# Altium schematic sheet Encoder_BR.SchDoc
size A4; Date: 09 July 2012; Author: Simon Markham; DrawnBy: Simon Markham; Engineer: Simon Markham; Organization: Markham Designs
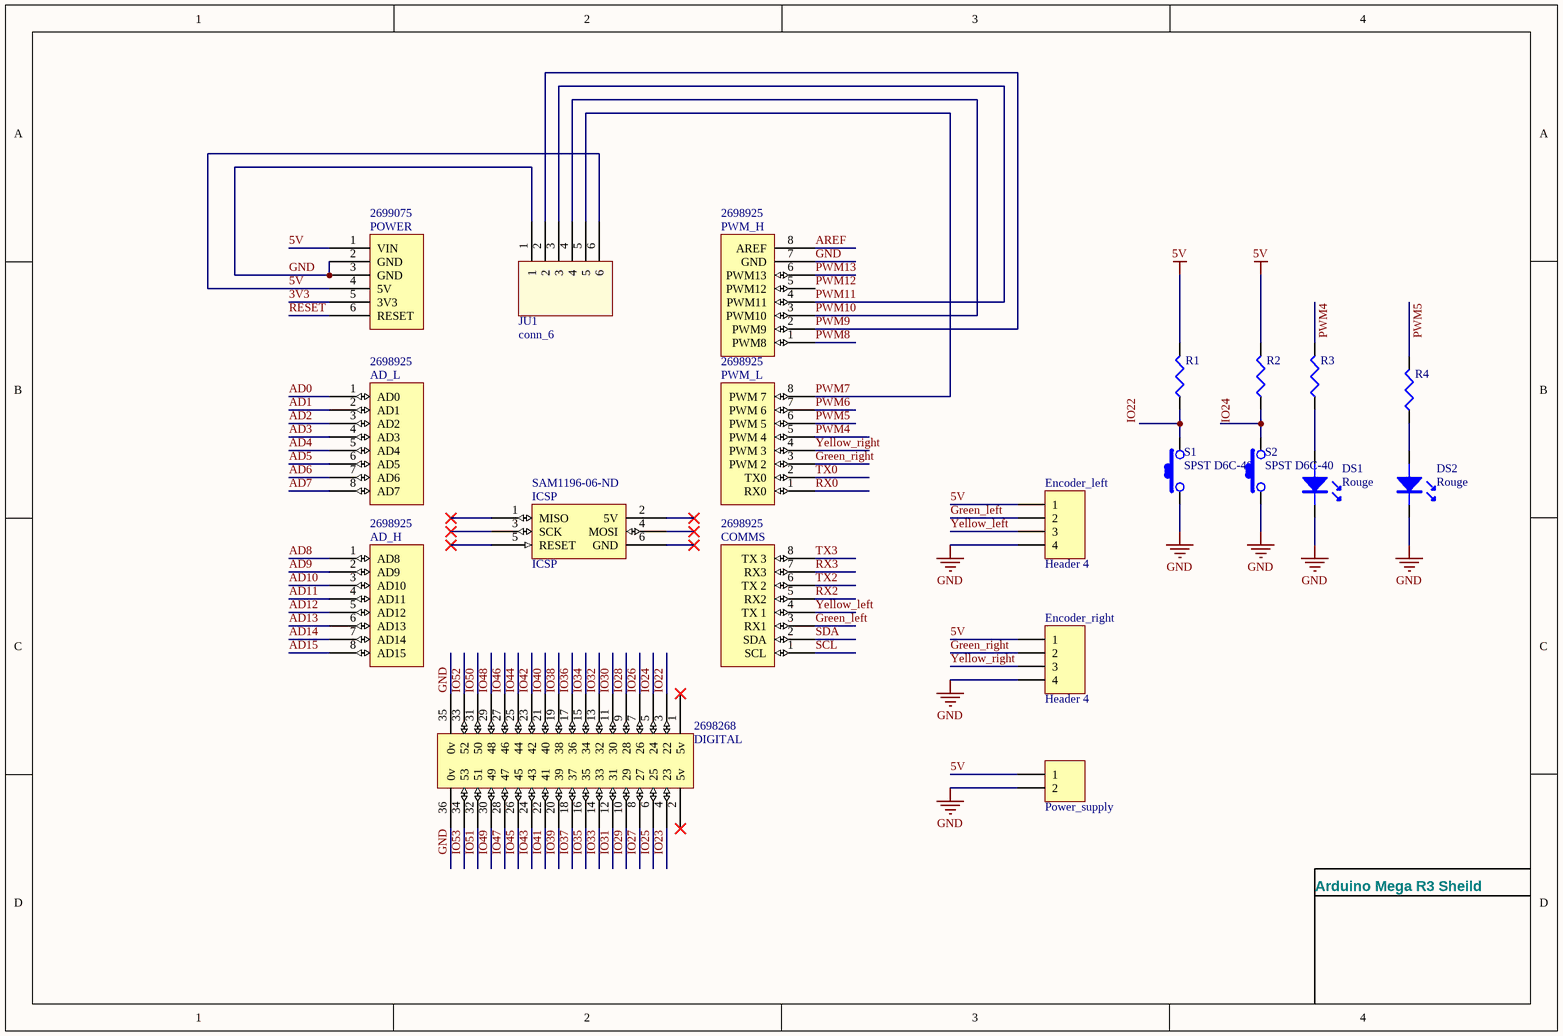
[diagram p0: Encoder_BR.SchDoc]

## Parts
AD_H  Supplier Part Number 4: 2698925  [Header 8x1 8.5mm]  (hidden comment: AD_H)
AD_L  Supplier Part Number 5: 2698925  [Header 8x1 8.5mm]  (hidden comment: AD_L)
COMMS  Supplier Part Number 4: 2698925  [Header 8x1 8.5mm]  (hidden comment: Communication)
DIGITAL  Supplier Part Number 5: 2698268  [HEADER 36X 8MM]  (hidden comment: IO_36)
DS1  Color: Rouge  [LED 0.1]  (hidden comment: LED)
DS2  Color: Rouge  [LED 0.1]  (hidden comment: LED)
Encoder_left  Header 4  [Header_4]
Encoder_right  Header 4  [Header_4]
ICSP  ICSP  Supplier Part Number 5: SAM1196-06-ND  [ICSP]
JU1  conn_6  [conn_6]
POWER  Supplier Part Number 2: 2699075  [Header 6x1 8.5mm]  (hidden comment: POWER)
Power_supply  Connecteur 2  [Header_2]  (value not drawn)
PWM_H  Supplier Part Number 4: 2698925  [Header 8x1 8.5mm]  (hidden comment: PWM_H)
PWM_L  Supplier Part Number 4: 2698925  [Header 8x1 8.5mm]  (hidden comment: PWM_L)
R1  Résistance  [AXIAL-0.3]  (value not drawn)
R2  Résistance  [AXIAL-0.3]  (value not drawn)
R3  Résistance  [AXIAL-0.3]  (value not drawn)
R4  Résistance  [AXIAL-0.3]  (value not drawn)
S1  Type: SPST D6C-40  [BP-D6 SPST]  (hidden comment: Bouton Poussoir D6)
S2  Type: SPST D6C-40  [BP-D6 SPST]  (hidden comment: Bouton Poussoir D6)

## Nets
5V: Encoder_left.1 Encoder_right.1 JU1.6 POWER.1(VIN) POWER.4(5V) Power_supply.1 R1.2 R2.2
GND: DIGITAL.35(0v) DIGITAL.36(0v) DS1.2(K) DS2.2(K) Encoder_left.4 Encoder_right.4 JU1.1 POWER.2(GND) POWER.3(GND) Power_supply.2 PWM_H.7(GND) S1.1 S2.1
3V3: POWER.5(3V3)
AD0: AD_L.1(AD0)
AD1: AD_L.2(AD1)
AD2: AD_L.3(AD2)
AD3: AD_L.4(AD3)
AD4: AD_L.5(AD4)
AD5: AD_L.6(AD5)
AD6: AD_L.7(AD6)
AD7: AD_L.8(AD7)
AD8: AD_H.1(AD8)
AD9: AD_H.2(AD9)
AD10: AD_H.3(AD10)
AD11: AD_H.4(AD11)
AD12: AD_H.5(AD12)
AD13: AD_H.6(AD13)
AD14: AD_H.7(AD14)
AD15: AD_H.8(AD15)
AREF: PWM_H.8(AREF)
Green_left: COMMS.3(RX1) Encoder_left.2
Green_right: Encoder_right.2 PWM_L.3(PWM_2)
IO22: DIGITAL.3(22) R1.1 S1.2
IO23: DIGITAL.4(23)
IO24: DIGITAL.5(24) R2.1 S2.2
IO25: DIGITAL.6(25)
IO26: DIGITAL.7(26)
IO27: DIGITAL.8(27)
IO28: DIGITAL.9(28)
IO29: DIGITAL.10(29)
IO30: DIGITAL.11(30)
IO31: DIGITAL.12(31)
IO32: DIGITAL.13(32)
IO33: DIGITAL.14(33)
IO34: DIGITAL.15(34)
IO35: DIGITAL.16(35)
IO36: DIGITAL.17(36)
IO37: DIGITAL.18(37)
IO38: DIGITAL.19(38)
IO39: DIGITAL.20(39)
IO40: DIGITAL.21(40)
IO41: DIGITAL.22(41)
IO42: DIGITAL.23(42)
IO43: DIGITAL.24(43)
IO44: DIGITAL.25(44)
IO45: DIGITAL.26(45)
IO46: DIGITAL.27(46)
IO47: DIGITAL.28(47)
IO48: DIGITAL.29(48)
IO49: DIGITAL.30(49)
IO50: DIGITAL.31(50)
IO51: DIGITAL.32(51)
IO52: DIGITAL.33(52)
IO53: DIGITAL.34(53)
PWM4: PWM_L.5(PWM_4) R3.2
PWM5: PWM_L.6(PWM_5) R4.2
PWM6: PWM_L.7(PWM_6)
PWM7: JU1.5 PWM_L.8(PWM_7)
PWM8: PWM_H.1(PWM8)
PWM9: JU1.2 PWM_H.2(PWM9)
PWM10: JU1.4 PWM_H.3(PWM10)
PWM11: JU1.3 PWM_H.4(PWM11)
PWM12: PWM_H.5(PWM12)
PWM13: PWM_H.6(PWM13)
RESET: POWER.6(RESET)
RX0: PWM_L.1(RX0)
RX2: COMMS.5(RX2)
RX3: COMMS.7(RX3)
SCL: COMMS.1(SCL)
SDA: COMMS.2(SDA)
TX0: PWM_L.2(TX0)
TX2: COMMS.6(TX_2)
TX3: COMMS.8(TX_3)
Yellow_left: COMMS.4(TX_1) Encoder_left.3
Yellow_right: Encoder_right.3 PWM_L.4(PWM_3)
NetDS1_1: DS1.1(A) R3.1
NetDS2_1: DS2.1(A) R4.1

Not connected (* = marked no-connect by the designer): DIGITAL 1(5v)* 2(5v)*; ICSP 1(MISO)* 2(5V)* 3(SCK)* 4(MOSI)* 5(RESET)* 6(GND)*

## Notes on the sheet
- Arduino Mega R3 Sheild

## Library data of the parts
Encoder_left Encoder_right = Header 4: Header, 4-Pin; LatestRevisionDate: 17-Jul-2002; LatestRevisionNote: Re-released for DXP Platform.; Publisher: Altium Limited; Supplier: Farnell 9731164
JU1 = conn_6: pin to pad: 1>2 2>3 3>4 4>5 5>6 6>1
Power_supply = Connecteur 2: Header 2; Designer: ECAM 2005; Supplier: ECAM; Type: Connecteur à vis
R1-R4 = Résistance: Résistance standard; Designer: ECAM 2005; Type: Résistance standard
S1 S2 = Bouton Poussoir D6: Bouton poussoir; Manufacturer: ITT CANON; Supplier: Farnell 151-141; Designer: ECAM 2004; Color: Rouge
AD_H = AD_H: Supplier 1: Arrow; Supplier Part Number 1: 2698940; Supplier 2: Arrow; Supplier Part Number 2: 2698939; Supplier 3: Digi-Key; Supplier Part Number 3: SAM1198-08-ND; Supplier 4: Arrow
AD_L = AD_L: Supplier 1: Digi-Key; Supplier Part Number 1: SAM1198-08-ND; Supplier 2: Arrow; Supplier Part Number 2: 2698939; Supplier 3: Arrow; Supplier Part Number 3: 2698940; Supplier 4: Arrow; Supplier Part Number 4: 43085273; Supplier 5: Arrow
COMMS = Communication: Supplier 1: Digi-Key; Supplier Part Number 1: SAM1198-08-ND; Supplier 2: Arrow; Supplier Part Number 2: 2698940; Supplier 3: Arrow; Supplier Part Number 3: 2698939; Supplier 4: Arrow
DIGITAL = IO_36: Supplier 1: Digi-Key; Supplier Part Number 1: SAM1196-18-ND; Supplier 2: Arrow; Supplier Part Number 2: 48117090; Supplier 3: Arrow; Supplier Part Number 3: 46093326; Supplier 4: Arrow; Supplier Part Number 4: 2698278; Supplier 5: Arrow
DS1 DS2 = LED: Designer: ECAM 2004; Type: LED
ICSP = ICSP: Supplier 1: Digi-Key; Supplier Part Number 1: SAM1185-06-ND; Supplier 2: Arrow; Supplier Part Number 2: 2699117; Supplier 3: Arrow; Supplier Part Number 3: 43862781; Supplier 4: Arrow; Supplier Part Number 4: 2699091; Supplier 5: Digi-Key
POWER = POWER: Supplier 1: Arrow; Supplier Part Number 1: 52553843; Supplier 2: Arrow; Supplier 3: Digi-Key; Supplier Part Number 3: SAM1198-06-ND; Supplier 4: Arrow; Supplier Part Number 4: 2699089; Supplier 5: Arrow; Supplier Part Number 5: 2699088
PWM_H = PWM_H: Supplier 1: Digi-Key; Supplier Part Number 1: SAM1198-08-ND; Supplier 2: Arrow; Supplier Part Number 2: 2698940; Supplier 3: Arrow; Supplier Part Number 3: 2698939; Supplier 4: Arrow
PWM_L = PWM_L: Supplier 1: Arrow; Supplier Part Number 1: 2698940; Supplier 2: Arrow; Supplier Part Number 2: 2698939; Supplier 3: Digi-Key; Supplier Part Number 3: SAM1198-08-ND; Supplier 4: Arrow